# EAGLE schematic A6BP-3 (EAGLE 7.5.0)

## Sheet 1 of 5
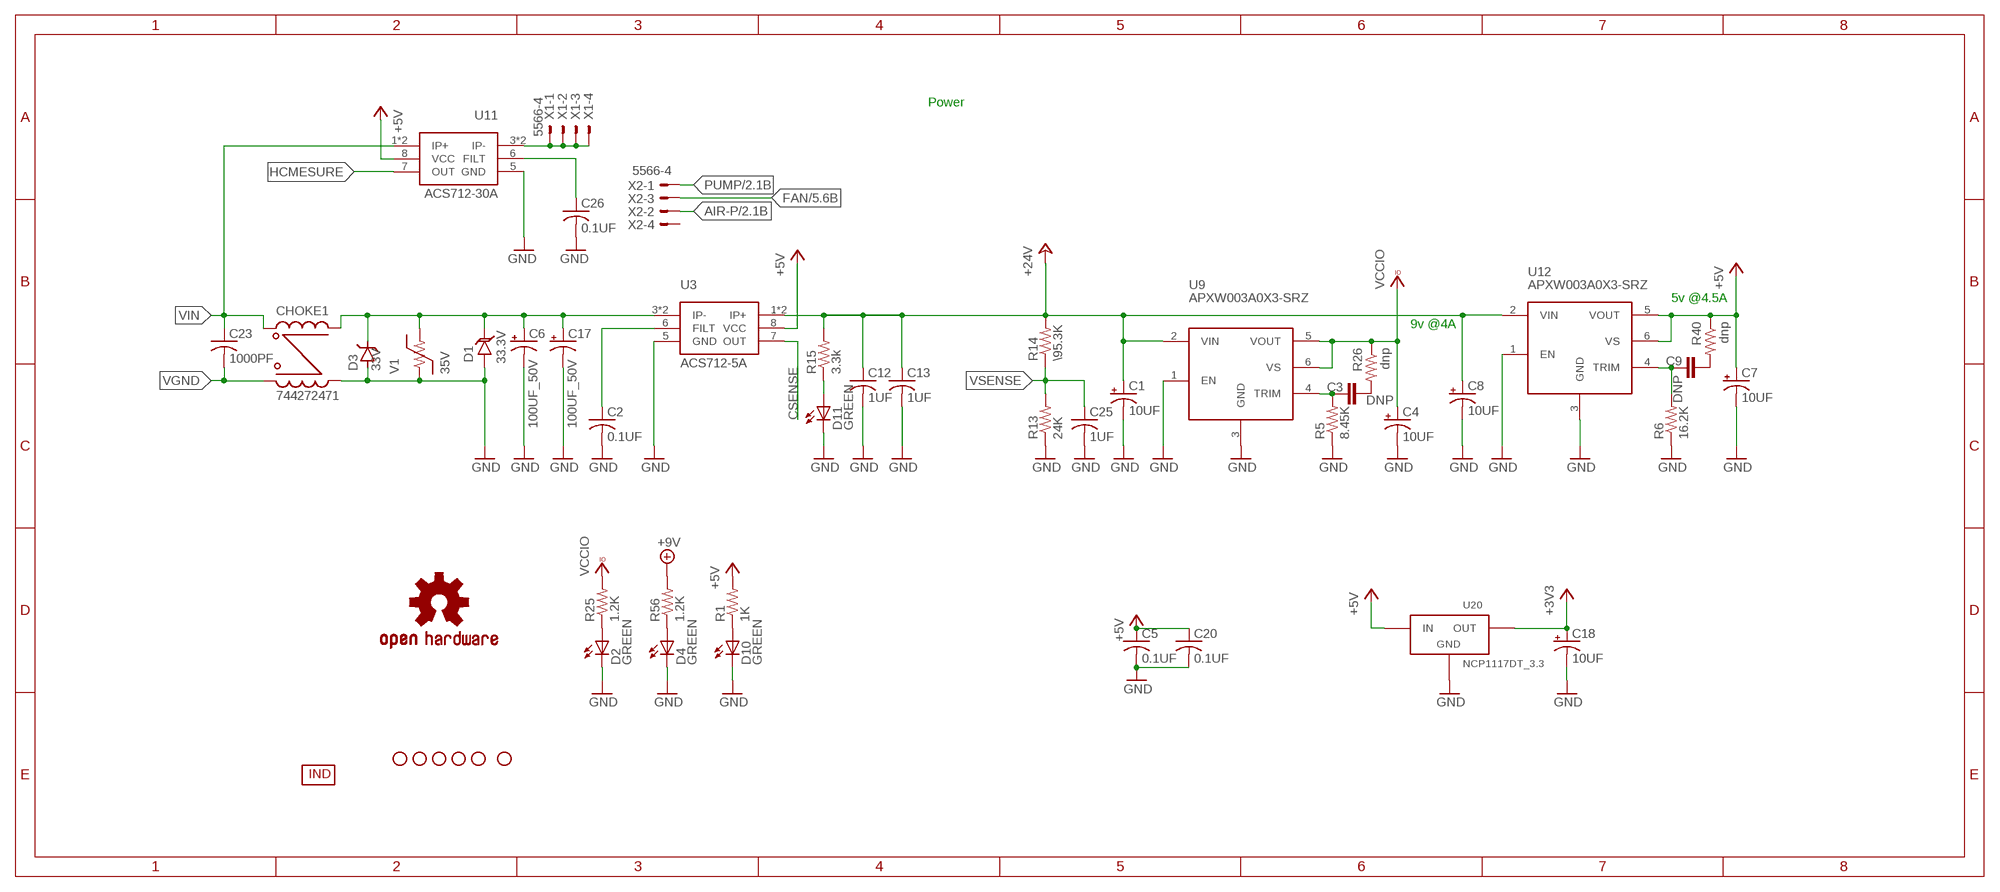
[diagram p0: schematic, sheet 1]

### Parts
C1  10UF  CAP-POL_10UF_60V  [EIA7343]
C2  0.1UF  CAP_0.1UF_50V_0805  [0805]
C3  DNP  CAP0805  [0805]
C4  10UF  CAP-POL_10UF_16V  [EIA3216-16V]
C5  0.1UF  CAP_0.1UF_50V_0805  [0805]
C6  100UF_50V  CAP-POL_100UF_50V_SMD  [PANASONIC-G]
C7  10UF  CAP-POL_10UF_16V  [EIA3216-16V]
C8  10UF  CAP-POL_10UF_60V  [EIA7343]
C9  DNP  CAP0805  [0805]
C12  1UF  CAP_1UF_50V  [1206@1]
C13  1UF  CAP_1UF_50V  [1206@1]
C17  100UF_50V  CAP-POL_100UF_50V_SMD  [PANASONIC-G]
C18  10UF  CAP-POL_10UF_16V  [EIA3216-16V]
C20  0.1UF  CAP_0.1UF_50V_0805  [0805]
C23  1000PF  CAP_1000PF_2KV  [C1825]
C25  1UF  CAP_1UF_50V_0805  [0805]
C26  0.1UF  CAP_0.1UF_50V_0805  [0805]
CHOKE1  744272471  [744272471]
D1  33.3V  TVS_33.3V  [SMA]
D2  GREEN  LED_GREEN  [CHIP_LED0805]
D3  33V  DIODE-ZENER_33V  [SMB]
D4  GREEN  LED_GREEN  [CHIP_LED0805]
D10  GREEN  LED_GREEN  [CHIP_LED0805]
D11  GREEN  LED_GREEN  [CHIP_LED0805]
R1  1K  RES_1K_1%_0805  [0805]
R5  8.45K  RES_8.45K_1%_0805  [0805]
R6  16.2K  RES_16.2K_1%_0805  [0805]
R13  24K  RES_24K_1%_0805  [0805]
R14  \95.3K  RES_95.3K_1%  [0805]
R15  3.3k  RES_3.3K_1%_0805  [0805]
R25  1.2K  RES_1.2K_1%_0805  [0805]
R26  dnp  R-US_R0805  [R0805]
R40  dnp  R-US_R0805  [R0805]
R56  1.2K  RES_1.2K_1%_0805  [0805]
STANDOFF2  STAND-OFF  [STAND-OFF]
STANDOFF3  STAND-OFF  [STAND-OFF]
STANDOFF5  STAND-OFF  [STAND-OFF]
STANDOFF6  STAND-OFF  [STAND-OFF]
STANDOFF7  STAND-OFF  [STAND-OFF]
STANDOFF8  STAND-OFF  [STAND-OFF]
U3  ACS712-5A  [SO-8]
U9  APXW003A0X3-SRZ  [APXW003A0X3-SRZ]
U11  ACS712-30A  [SO-8]
U12  APXW003A0X3-SRZ  [APXW003A0X3-SRZ]
U20  NCP1117DT_3.3  [DPAK]
U$8  OSHW-LOGOM  [OSHW-LOGO-M]
U$9  INDPK1  [PICKIT-PIN-1]
V1  35V  VARISTOR_35V  [0805]
X1  5566-4  [5566-4]
X2  5566-4  [5566-4]

### Nets
+3V3: C18.A(+) U20.2(OUT) ; also sheet 2
+5V: C5.1(+) C7.A(+) C20.1(+) R1.2 R40.1 U3.8(VCC) U11.8(VCC) U12.5(VOUT) U12.6(VS) U20.3(IN) ; also sheet 2,3,4,5
+9V: R56.2
+24V: C1.A(+) C8.A(+) C12.1(+) C13.1(+) R14.2 R15.2 U3.1(IP+) U3.2(IP+) U9.2(VIN) U12.2(VIN) ; also sheet 2,3
AIR-P: X2.2 ; also sheet 2
CSENSE: U3.7(OUT) ; also sheet 4
FAN: X2.3 ; also sheet 5
GND: C1.C(-) C2.2(-) C4.C(-) C5.2(-) C6.- C7.C(-) C8.C(-) C12.2(-) C13.2(-) C17.- C18.C(-) C20.2(-) C25.2(-) C26.2(-) CHOKE1.2 D1.A D2.C D3.A D4.C D10.C D11.C R5.1 R6.1 R13.1 U3.5(GND) U9.1(EN) U9.3(GND) U11.5(GND) U12.1(EN) U12.3(GND) U20.1(GND) V1.1 ; also sheet 2,3,4,5
HCMESURE: U11.7(OUT) ; also sheet 4
N$1: D2.A R25.1
N$3: D4.A R56.1
N$8: D10.A R1.1
N$18: C2.1(+) U3.6(FILT)
N$30: C6.+ C17.+ CHOKE1.3 D1.C D3.C U3.3(IP-) U3.4(IP-) V1.2
N$35: C3.1 R26.2
N$37: C3.2 R5.2 U9.4(TRIM)
N$42: D11.A R15.1
N$59: C9.1 R40.2
N$60: C9.2 R6.2 U12.4(TRIM)
N$61: U11.3(IP-) U11.4(IP-) X1.1 X1.2 X1.3 X1.4
N$63: C26.1(+) U11.6(FILT)
PUMP: X2.1 ; also sheet 2
VCCIO: C4.A(+) R25.2 R26.1 U9.5(VOUT) U9.6(VS) ; also sheet 4
VGND: C23.2(-) CHOKE1.1 ; also sheet 2
VIN: C23.1(+) CHOKE1.4 U11.1(IP+) U11.2(IP+) ; also sheet 2
VSENSE: C25.1(+) R13.2 R14.1 ; also sheet 4
Unconnected: X2.4

### Notes on the sheet
- Power
- 5v @4.5A
- 9v @4A

## Sheet 2 of 5
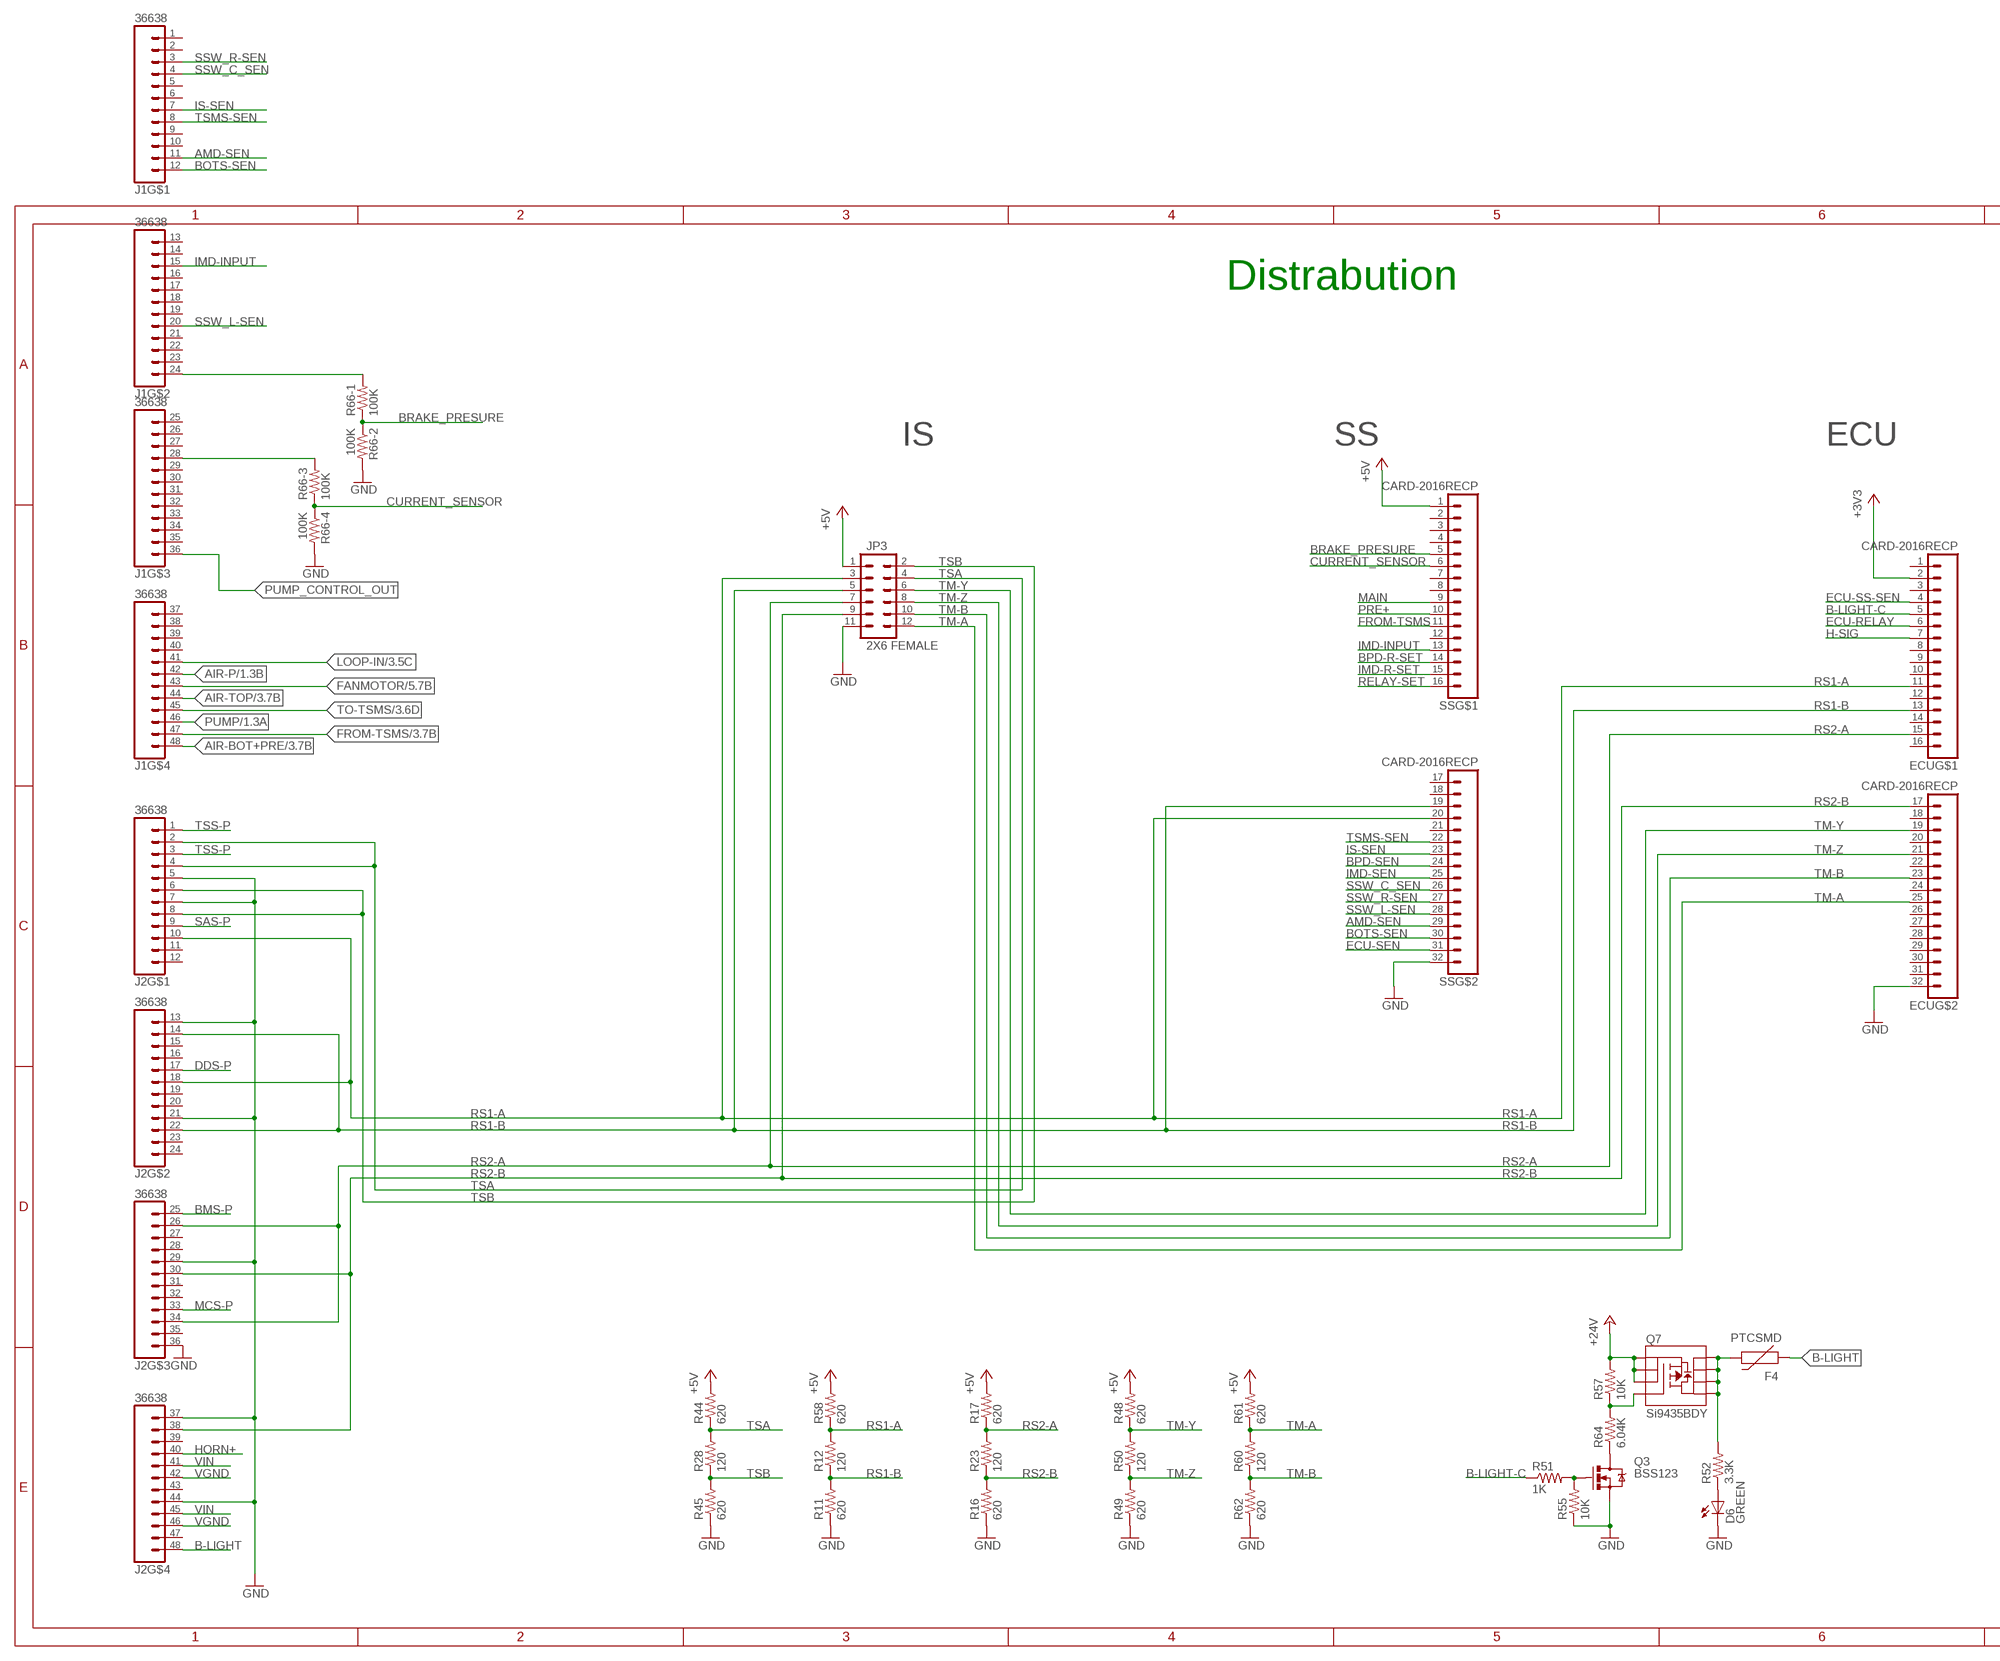
[diagram p1: schematic, sheet 2, part 1 of 2]
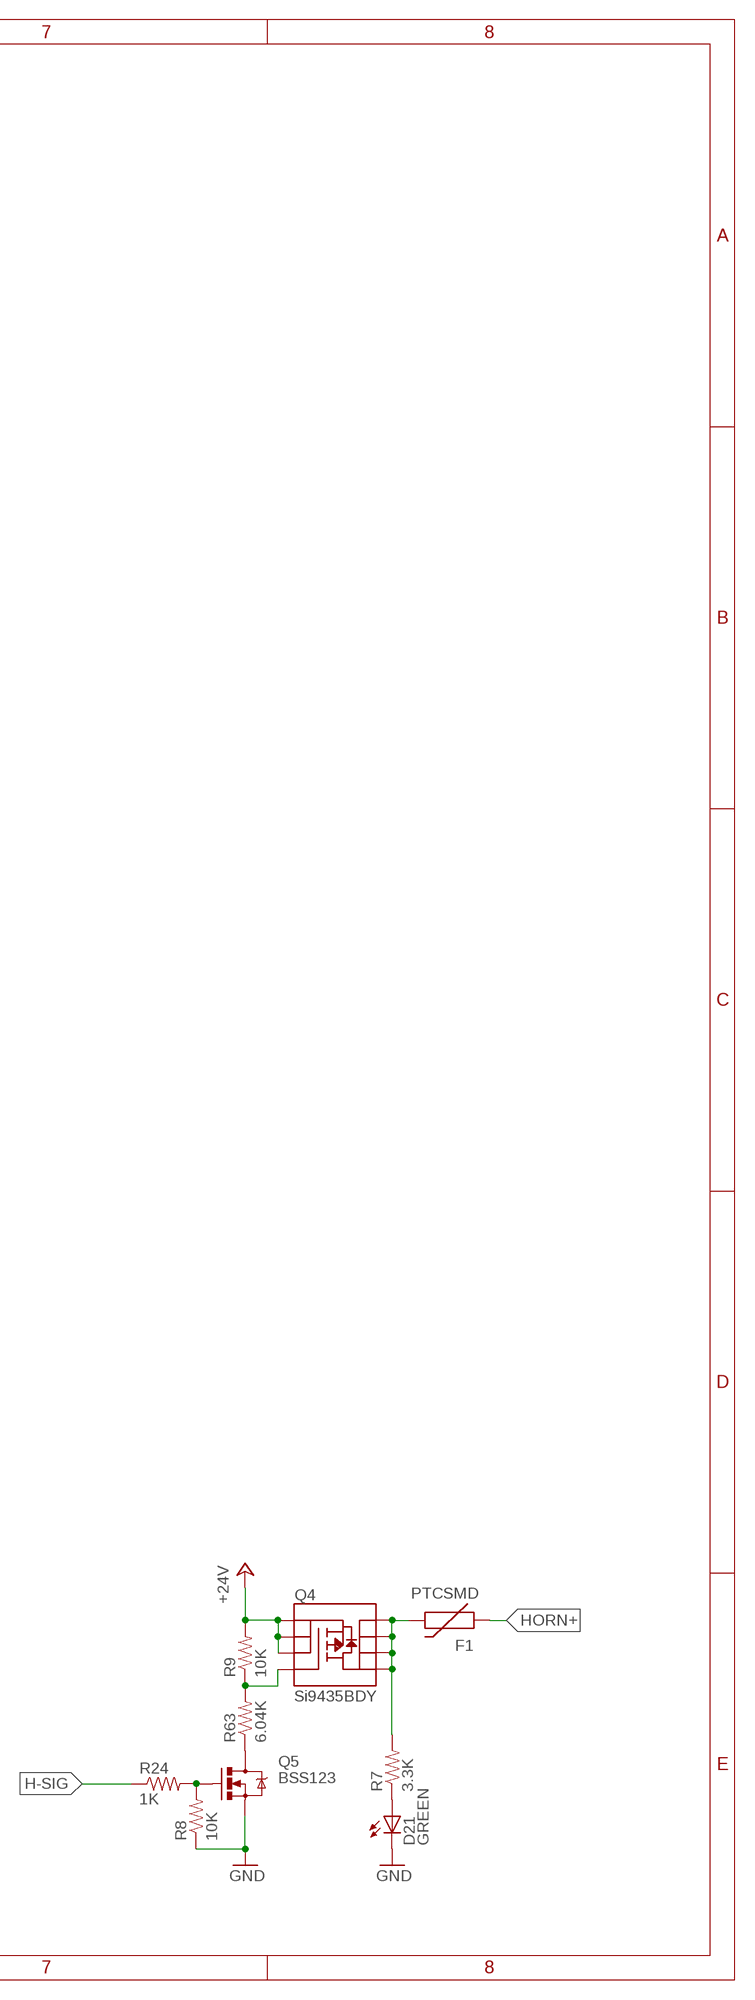
[diagram p2: schematic, sheet 2, part 2 of 2]

### Parts
D6  GREEN  LED_GREEN  [CHIP_LED0805]
D21  GREEN  LED_GREEN  [CHIP_LED0805]
ECU  CARD-2016RECP  [CARD-2016-RCP]
F1  PTCSMD  [PTC-1206]
F4  PTCSMD  [PTC-1206]
J1  36638  [36638]
J2  36638  [36638]
JP3  2X6 FEMALE  M06X2PTH_FEMALE  [2X6]
Q3  BSS123  MOS-N_BSS123  [SOT23]
Q4  Si9435BDY  MOSFET-PCHANNEL-SOIC8SOIC8  [SO08]
Q5  BSS123  MOS-N_BSS123  [SOT23]
Q7  Si9435BDY  MOSFET-PCHANNEL-SOIC8SOIC8  [SO08]
R7  3.3K  RES_3.3K_1%_0805  [0805]
R8  10K  RES_10K_1%_0805  [0805]
R9  10K  RES_10K_1%_0805  [0805]
R11  620  RES_620_1%_0805  [0805]
R12  120  RES_120_1%_0805  [0805]
R16  620  RES_620_1%_0805  [0805]
R17  620  RES_620_1%_0805  [0805]
R23  120  RES_120_1%_0805  [0805]
R24  1K  RES_1K_1%_0805  [0805]
R28  120  RES_120_1%_0805  [0805]
R44  620  RES_620_1%_0805  [0805]
R45  620  RES_620_1%_0805  [0805]
R48  620  RES_620_1%_0805  [0805]
R49  620  RES_620_1%_0805  [0805]
R50  120  RES_120_1%_0805  [0805]
R51  1K  RES_1K_1%_0805  [0805]
R52  3.3K  RES_3.3K_1%_0805  [0805]
R55  10K  RES_10K_1%_0805  [0805]
R57  10K  RES_10K_1%_0805  [0805]
R58  620  RES_620_1%_0805  [0805]
R60  120  RES_120_1%_0805  [0805]
R61  620  RES_620_1%_0805  [0805]
R62  620  RES_620_1%_0805  [0805]
R63  6.04K  RES_6.04K_1%  [0805]
R64  6.04K  RES_6.04K_1%  [0805]
R66  100K  RN-4_100K  [MNR14]
SS  CARD-2016RECP  [CARD-2016-RCP]

### Nets
+3V3: ECU.2 ; also sheet 1
+5V: JP3.1 R17.2 R44.2 R48.2 R58.2 R61.2 SS.1 ; also sheet 1,3,4,5
+24V: Q4.1(S) Q4.2(S) Q4.3(S) Q7.1(S) Q7.2(S) Q7.3(S) R9.2 R57.2 ; also sheet 1,3
AIR-BOT+PRE: J1.48 ; also sheet 3
AIR-P: J1.42 ; also sheet 1
AIR-TOP: J1.44 ; also sheet 3
AMD-SEN: J1.11 SS.29
B-LIGHT: F4.1 J2.48
B-LIGHT-C: ECU.5 R51.1
BMS-P: J2.25 ; also sheet 4
BOTS-SEN: J1.12 SS.30
BPD-R-SET: SS.14 ; also sheet 3
BPD-SEN: SS.24 ; also sheet 3
BRAKE_PRESURE: R66.1 R66.2 SS.5
CURRENT_SENSOR: R66.3 R66.4 SS.6
DDS-P: J2.17 ; also sheet 4
ECU-RELAY: ECU.6 ; also sheet 3
ECU-SEN: SS.31 ; also sheet 3
ECU-SS-SEN: ECU.4
FANMOTOR: J1.43 ; also sheet 5
FROM-TSMS: J1.47 SS.11 ; also sheet 3
GND: D6.C D21.C ECU.32 J2.5 J2.7 J2.13 J2.21 J2.29 J2.36 J2.37 J2.44 JP3.11 Q3.2(S) Q5.2(S) R8.1 R11.1 R16.1 R45.1 R49.1 R55.1 R62.1 R66.5 R66.7 SS.32 ; also sheet 1,3,4,5
H-SIG: ECU.7 R24.1
HORN+: F1.1 J2.40
IMD-INPUT: J1.15 SS.13
IMD-R-SET: SS.15 ; also sheet 3
IMD-SEN: SS.25 ; also sheet 3
IS-SEN: J1.7 SS.23
LOOP-IN: J1.41 ; also sheet 3
MAIN: SS.9 ; also sheet 3
MCS-P: J2.33 ; also sheet 4
N$5: Q4.4(G) R9.1 R63.2
N$9: F1.2 Q4.5(D) Q4.6(D) Q4.7(D) Q4.8(D) R7.2
N$12: D21.A R7.1
N$13: F4.2 Q7.5(D) Q7.6(D) Q7.7(D) Q7.8(D) R52.2
N$32: Q7.4(G) R57.1 R64.2
N$34: D6.A R52.1
N$41: Q5.1(G) R8.2 R24.2
N$52: Q5.3(D) R63.1
N$53: Q3.3(D) R64.1
N$57: J1.24 R66.8
N$84: Q3.1(G) R51.2 R55.2
N$87: J1.28 R66.6
PRE+: SS.10 ; also sheet 3
PUMP: J1.46 ; also sheet 1
PUMP_CONTROL_OUT: J1.36 ; also sheet 5
RELAY-SET: SS.16 ; also sheet 3
RS1-A: ECU.11 J2.10 J2.18 JP3.3 R12.2 R58.1 SS.20
RS1-B: ECU.13 J2.14 J2.22 JP3.5 R11.2 R12.1 SS.19
RS2-A: ECU.15 J2.26 J2.34 JP3.7 R17.1 R23.2 ; also sheet 4
RS2-B: ECU.17 J2.30 J2.38 JP3.9 R16.2 R23.1 ; also sheet 4
SAS-P: J2.9 ; also sheet 4
SSW_C_SEN: J1.4 SS.26
SSW_L-SEN: J1.20 SS.28
SSW_R-SEN: J1.3 SS.27
TM-A: ECU.25 JP3.12 R60.2 R61.1
TM-B: ECU.23 JP3.10 R60.1 R62.2
TM-Y: ECU.19 JP3.6 R48.1 R50.2
TM-Z: ECU.21 JP3.8 R49.2 R50.1
TO-TSMS: J1.45 ; also sheet 3
TSA: J2.2 J2.4 JP3.4 R28.2 R44.1
TSB: J2.6 J2.8 JP3.2 R28.1 R45.2
TSMS-SEN: J1.8 SS.22
TSS-P: J2.1 J2.3 ; also sheet 4
VGND: J2.42 J2.46 ; also sheet 1
VIN: J2.41 J2.45 ; also sheet 1
Unconnected: ECU.1 ECU.3 ECU.8 ECU.9 ECU.10 ECU.12 ECU.14 ECU.16 ECU.18 ECU.20 ECU.22 ECU.24 ECU.26 ECU.27 ECU.28 ECU.29 ECU.30 ECU.31 J1.1 J1.2 J1.5 J1.6 J1.9 J1.10 J1.13 J1.14 J1.16 J1.17 J1.18 J1.19 J1.21 J1.22 J1.23 J1.25 J1.26 J1.27 J1.29 J1.30 J1.31 J1.32 J1.33 J1.34 J1.35 J1.37 J1.38 J1.39 J1.40 J2.11 J2.12 J2.15 J2.16 J2.19 J2.20 J2.23 J2.24 J2.27 J2.28 J2.31 J2.32 J2.35 J2.39 J2.43 J2.47 SS.2 SS.3 SS.4 SS.7 SS.8 SS.12 SS.17 SS.18 SS.21

### Notes on the sheet
- Distrabution
- IS | SS | ECU

## Sheet 3 of 5
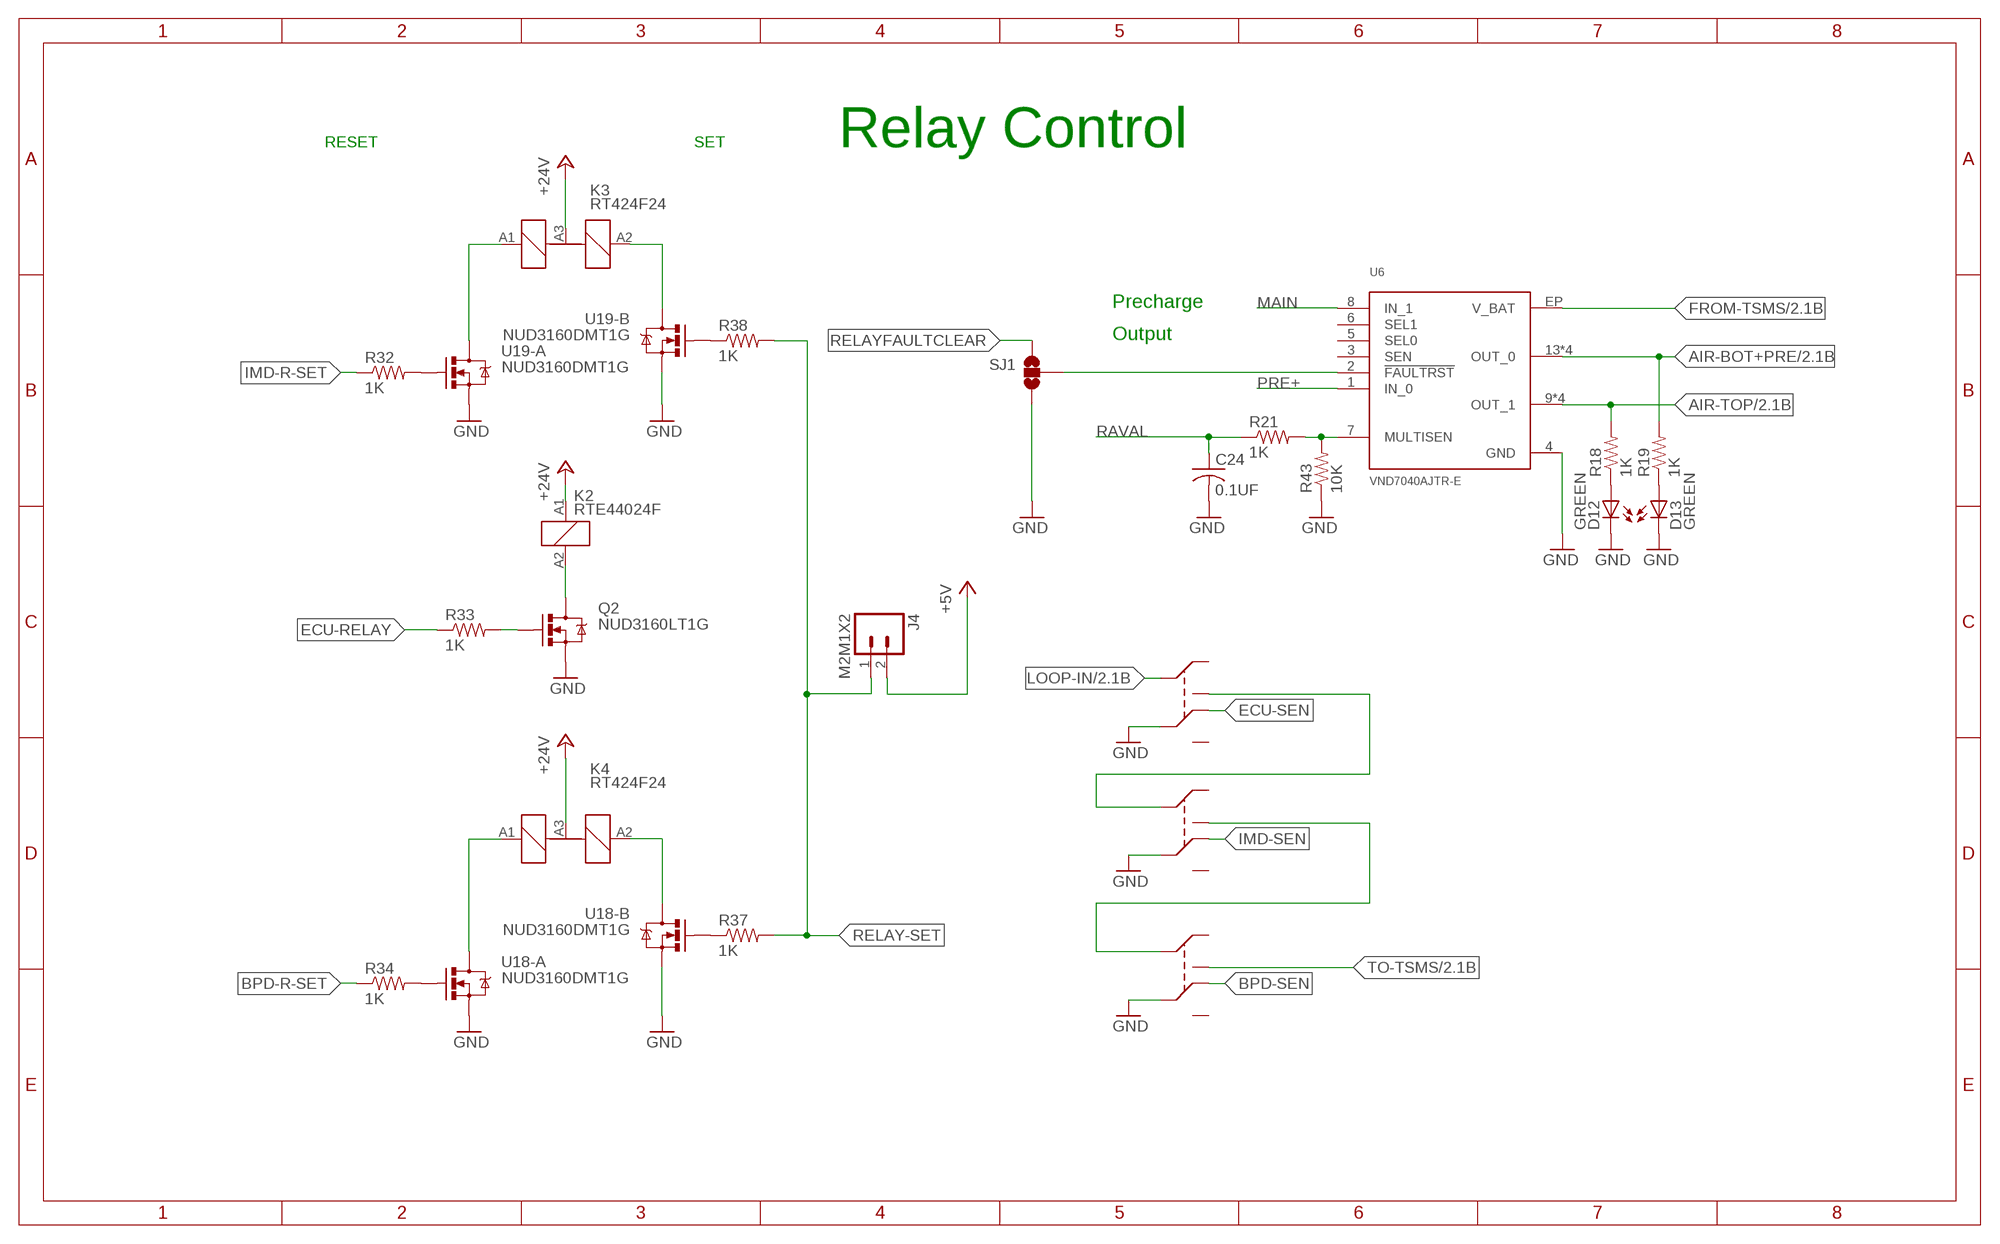
[diagram p3: schematic, sheet 3]

### Parts
C24  0.1UF  CAP_0.1UF_50V_0805  [0805]
D12  GREEN  LED_GREEN  [CHIP_LED0805]
D13  GREEN  LED_GREEN  [CHIP_LED0805]
J4  M2M1X2  [MOLEX-1X2]
K2  RTE44024F  [RTE44024F]
K3  RT424F24  [RT424F24]
K4  RT424F24  [RT424F24]
Q2  NUD3160LT1G  [SOT23]
R18  1K  RES_1K_1%_0805  [0805]
R19  1K  RES_1K_1%_0805  [0805]
R21  1K  RES_1K_1%_0805  [0805]
R32  1K  RES_1K_1%_0805  [0805]
R33  1K  RES_1K_1%_0805  [0805]
R34  1K  RES_1K_1%_0805  [0805]
R37  1K  RES_1K_1%_0805  [0805]
R38  1K  RES_1K_1%_0805  [0805]
R43  10K  RES_10K_1%_0805  [0805]
SJ1  JUMPER-PAD-3-NOFULL_BOX_SILK  [PAD-JUMPER-3-NO_YES_SILK_FULL_BOX]
U6  VND7040AJTR-E  [SSO-16-POWER]
U18  NUD3160DMT1G  [SC74-6]
U19  NUD3160DMT1G  [SC74-6]

### Nets
+5V: J4.2 ; also sheet 1,2,4,5
+24V: K2.A1(+) K3.A3(-) K4.A3(-) ; also sheet 1,2
AIR-BOT+PRE: R19.2 U6.13(OUT_0) U6.14(OUT_0) U6.15(OUT_0) U6.16(OUT_0) ; also sheet 2
AIR-TOP: R18.2 U6.9(OUT_1) U6.10(OUT_1) U6.11(OUT_1) U6.12(OUT_1) ; also sheet 2
BPD-R-SET: R34.1 ; also sheet 2
BPD-SEN: K4.22(NC2) ; also sheet 2
ECU-RELAY: R33.1 ; also sheet 2
ECU-SEN: K2.22(NC2) ; also sheet 2
FROM-TSMS: U6.EP(V_BAT) ; also sheet 2
GND: C24.2(-) D12.C D13.C K2.21(C2) K3.21(C2) K4.21(C2) Q2.2(S) R43.1 SJ1.3 U6.4(GND) U18.1(-A:S) U18.4(-B:S) U19.1(-A:S) U19.4(-B:S) ; also sheet 1,2,4,5
IMD-R-SET: R32.1 ; also sheet 2
IMD-SEN: K3.22(NC2) ; also sheet 2
LOOP-IN: K2.11(C1) ; also sheet 2
MAIN: U6.8(IN_1) ; also sheet 2
N$2: D12.A R18.1
N$6: R34.2 U18.2(-A:G)
N$7: K2.14(NO1) K3.11(C1)
N$10: D13.A R19.1
N$11: R21.2 R43.2 U6.7(MULTISEN)
N$14: SJ1.2 U6.2(!FAULTRST)
N$15: K3.14(NO1) K4.11(C1)
N$19: Q2.1(G) R33.2
N$23: R38.1 U19.5(-B:G)
N$45: K2.A2(-) Q2.3(D)
N$47: K3.A1(+1) U19.6(-A:D)
N$48: R32.2 U19.2(-A:G)
N$49: K3.A2(+2) U19.3(-B:D)
N$50: K4.A1(+1) U18.6(-A:D)
N$51: K4.A2(+2) U18.3(-B:D)
N$55: R37.1 U18.5(-B:G)
PRE+: U6.1(IN_0) ; also sheet 2
RAVAL: C24.1(+) R21.1
RELAY-SET: J4.1 R37.2 R38.2 ; also sheet 2
RELAYFAULTCLEAR: SJ1.1
TO-TSMS: K4.14(NO1) ; also sheet 2
Unconnected: K2.12(NC1) K2.24(NO2) K3.12(NC1) K3.24(NO2) K4.12(NC1) K4.24(NO2) U6.3(SEN) U6.5(SEL0) U6.6(SEL1)

### Notes on the sheet
- RESET | SET | Relay Control
- Precharge
- Output

## Sheet 4 of 5
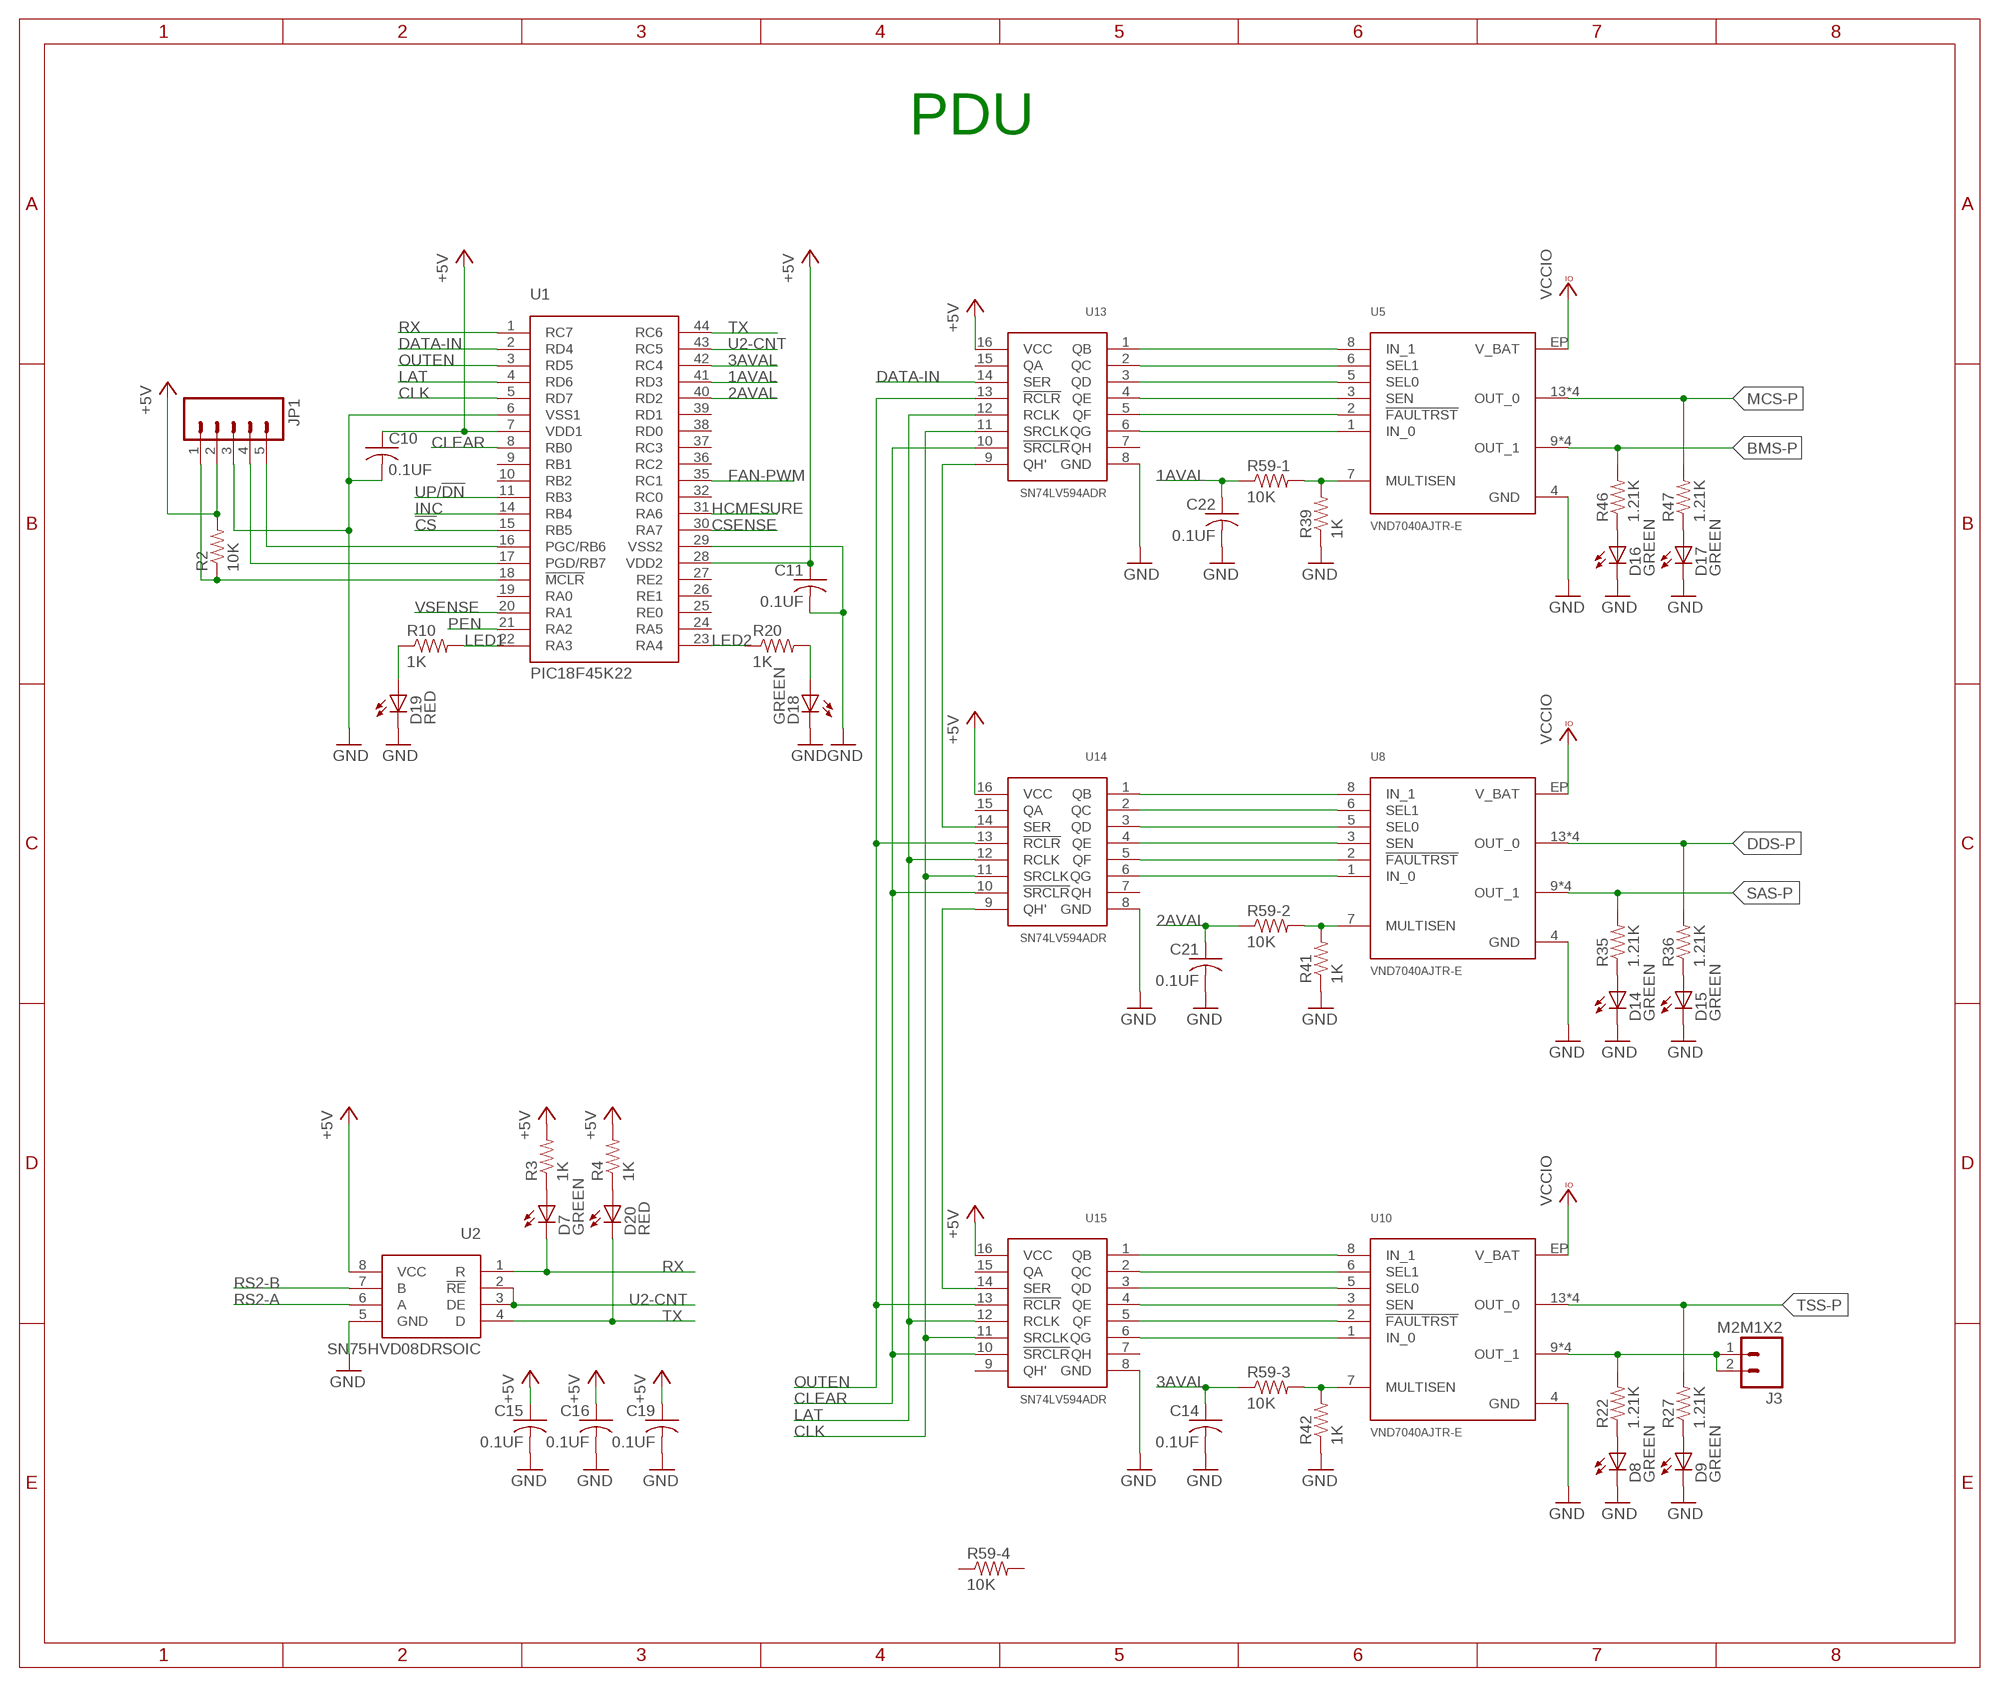
[diagram p4: schematic, sheet 4]

### Parts
C10  0.1UF  CAP_0.1UF_50V_0805  [0805]
C11  0.1UF  CAP_0.1UF_50V_0805  [0805]
C14  0.1UF  CAP_0.1UF_50V_0805  [0805]
C15  0.1UF  CAP_0.1UF_50V_0805  [0805]
C16  0.1UF  CAP_0.1UF_50V_0805  [0805]
C19  0.1UF  CAP_0.1UF_50V_0805  [0805]
C21  0.1UF  CAP_0.1UF_50V_0805  [0805]
C22  0.1UF  CAP_0.1UF_50V_0805  [0805]
D7  GREEN  LED_GREEN  [CHIP_LED0805]
D8  GREEN  LED_GREEN  [CHIP_LED0805]
D9  GREEN  LED_GREEN  [CHIP_LED0805]
D14  GREEN  LED_GREEN  [CHIP_LED0805]
D15  GREEN  LED_GREEN  [CHIP_LED0805]
D16  GREEN  LED_GREEN  [CHIP_LED0805]
D17  GREEN  LED_GREEN  [CHIP_LED0805]
D18  GREEN  LED_GREEN  [CHIP_LED0805]
D19  RED  LED_RED  [CHIP_LED0805]
D20  RED  LED_RED  [CHIP_LED0805]
J3  M2M1X2  [MOLEX-1X2]
JP1  M05LOCK_LONGPADS  [1X05_LOCK_LONGPADS]
R2  10K  RES_10K_1%_0805  [0805]
R3  1K  RES_1K_1%_0805  [0805]
R4  1K  RES_1K_1%_0805  [0805]
R10  1K  RES_1K_1%_0805  [0805]
R20  1K  RES_1K_1%_0805  [0805]
R22  1.21K  RES_1.21K_1%_0805  [0805]
R27  1.21K  RES_1.21K_1%_0805  [0805]
R35  1.21K  RES_1.21K_1%_0805  [0805]
R36  1.21K  RES_1.21K_1%_0805  [0805]
R39  1K  RES_1K_1%_0805  [0805]
R41  1K  RES_1K_1%_0805  [0805]
R42  1K  RES_1K_1%_0805  [0805]
R46  1.21K  RES_1.21K_1%_0805  [0805]
R47  1.21K  RES_1.21K_1%_0805  [0805]
R59  10K  RN-4_10K  [MNR14]
U1  PIC18F45K22  [TQFP-44]
U2  SN75HVD08DRSOIC  [SO-8]
U5  VND7040AJTR-E  [SSO-16-POWER]
U8  VND7040AJTR-E  [SSO-16-POWER]
U10  VND7040AJTR-E  [SSO-16-POWER]
U13  SN74LV594ADR  [SO-16]
U14  SN74LV594ADR  [SO-16]
U15  SN74LV594ADR  [SO-16]

### Nets
1AVAL: C22.1(+) R59.1 U1.41(RD3)
2AVAL: C21.1(+) R59.2 U1.40(RD2)
3AVAL: C14.1(+) R59.3 U1.42(RC4)
!CS: U1.15(RB5) ; also sheet 5
+5V: C10.1(+) C11.1(+) C15.1(+) C16.1(+) C19.1(+) JP1.2 R2.2 R3.2 R4.2 U1.7(VDD1) U1.28(VDD2) U2.8(VCC) U13.16(VCC) U14.16(VCC) U15.16(VCC) ; also sheet 1,2,3,5
BMS-P: R46.2 U5.9(OUT_1) U5.10(OUT_1) U5.11(OUT_1) U5.12(OUT_1) ; also sheet 2
CLEAR: U1.8(RB0) U13.10(!SRCLR) U14.10(!SRCLR) U15.10(!SRCLR)
CLK: U1.5(RD7) U13.11(SRCLK) U14.11(SRCLK) U15.11(SRCLK)
CSENSE: U1.30(RA7) ; also sheet 1
DATA-IN: U1.2(RD4) U13.14(SER)
DDS-P: R36.2 U8.13(OUT_0) U8.14(OUT_0) U8.15(OUT_0) U8.16(OUT_0) ; also sheet 2
FAN-PWM: U1.35(RC1) ; also sheet 5
GND: C10.2(-) C11.2(-) C14.2(-) C15.2(-) C16.2(-) C19.2(-) C21.2(-) C22.2(-) D8.C D9.C D14.C D15.C D16.C D17.C D18.C D19.C JP1.3 R39.1 R41.1 R42.1 U1.6(VSS1) U1.29(VSS2) U2.5(GND) U5.4(GND) U8.4(GND) U10.4(GND) U13.8(GND) U14.8(GND) U15.8(GND) ; also sheet 1,2,3,5
HCMESURE: U1.31(RA6) ; also sheet 1
INC: U1.14(RB4) ; also sheet 5
LAT: U1.4(RD6) U13.12(RCLK) U14.12(RCLK) U15.12(RCLK)
LED1: R10.2 U1.22(RA3)
LED2: R20.1 U1.23(RA4)
MCS-P: R47.2 U5.13(OUT_0) U5.14(OUT_0) U5.15(OUT_0) U5.16(OUT_0) ; also sheet 2
N$4: U5.8(IN_1) U13.1(QB)
N$16: D19.A R10.1
N$17: J3.1 J3.2 R22.2 U10.9(OUT_1) U10.10(OUT_1) U10.11(OUT_1) U10.12(OUT_1)
N$24: D7.A R3.1
N$25: D20.A R4.1
N$28: D8.A R22.1
N$29: D9.A R27.1
N$31: R42.2 R59.6 U10.7(MULTISEN)
N$33: U5.6(SEL1) U13.2(QC)
N$36: U5.5(SEL0) U13.3(QD)
N$39: U5.3(SEN) U13.4(QE)
N$40: JP1.4 U1.17(PGD/RB7)
N$43: JP1.5 U1.16(PGC/RB6)
N$44: U5.2(!FAULTRST) U13.5(QF)
N$46: JP1.1 R2.1 U1.18(!MCLR)
N$54: D18.A R20.2
N$58: U13.9(QH') U14.14(SER)
N$62: U5.1(IN_0) U13.6(QG)
N$64: U8.8(IN_1) U14.1(QB)
N$65: U8.6(SEL1) U14.2(QC)
N$66: U8.5(SEL0) U14.3(QD)
N$67: D14.A R35.1
N$68: D15.A R36.1
N$69: R39.2 R59.8 U5.7(MULTISEN)
N$70: U8.3(SEN) U14.4(QE)
N$71: U8.2(!FAULTRST) U14.5(QF)
N$72: U8.1(IN_0) U14.6(QG)
N$73: U10.8(IN_1) U15.1(QB)
N$74: U10.6(SEL1) U15.2(QC)
N$75: U10.5(SEL0) U15.3(QD)
N$76: U10.3(SEN) U15.4(QE)
N$77: U10.2(!FAULTRST) U15.5(QF)
N$78: U10.1(IN_0) U15.6(QG)
N$79: D16.A R46.1
N$80: U14.9(QH') U15.14(SER)
N$83: D17.A R47.1
N$85: R41.2 R59.7 U8.7(MULTISEN)
OUTEN: U1.3(RD5) U13.13(!RCLR) U14.13(!RCLR) U15.13(!RCLR)
PEN: U1.21(RA2)
RS2-A: U2.6(A) ; also sheet 2
RS2-B: U2.7(B) ; also sheet 2
RX: D7.C U1.1(RC7) U2.1(R)
SAS-P: R35.2 U8.9(OUT_1) U8.10(OUT_1) U8.11(OUT_1) U8.12(OUT_1) ; also sheet 2
TSS-P: R27.2 U10.13(OUT_0) U10.14(OUT_0) U10.15(OUT_0) U10.16(OUT_0) ; also sheet 2
TX: D20.C U1.44(RC6) U2.4(D)
U2-CNT: U1.43(RC5) U2.2(!RE) U2.3(DE)
UP/!DN: U1.11(RB3) ; also sheet 5
VCCIO: U5.EP(V_BAT) U8.EP(V_BAT) U10.EP(V_BAT) ; also sheet 1
VSENSE: U1.20(RA1) ; also sheet 1
Unconnected: R59.4 R59.5 U1.9(RB1) U1.10(RB2) U1.19(RA0) U1.24(RA5) U1.25(RE0) U1.26(RE1) U1.27(RE2) U1.32(RC0) U1.36(RC2) U1.37(RC3) U1.38(RD0) U1.39(RD1) U13.7(QH) U13.15(QA) U14.7(QH) U14.15(QA) U15.7(QH) U15.9(QH') U15.15(QA)

### Notes on the sheet
- PDU

## Sheet 5 of 5
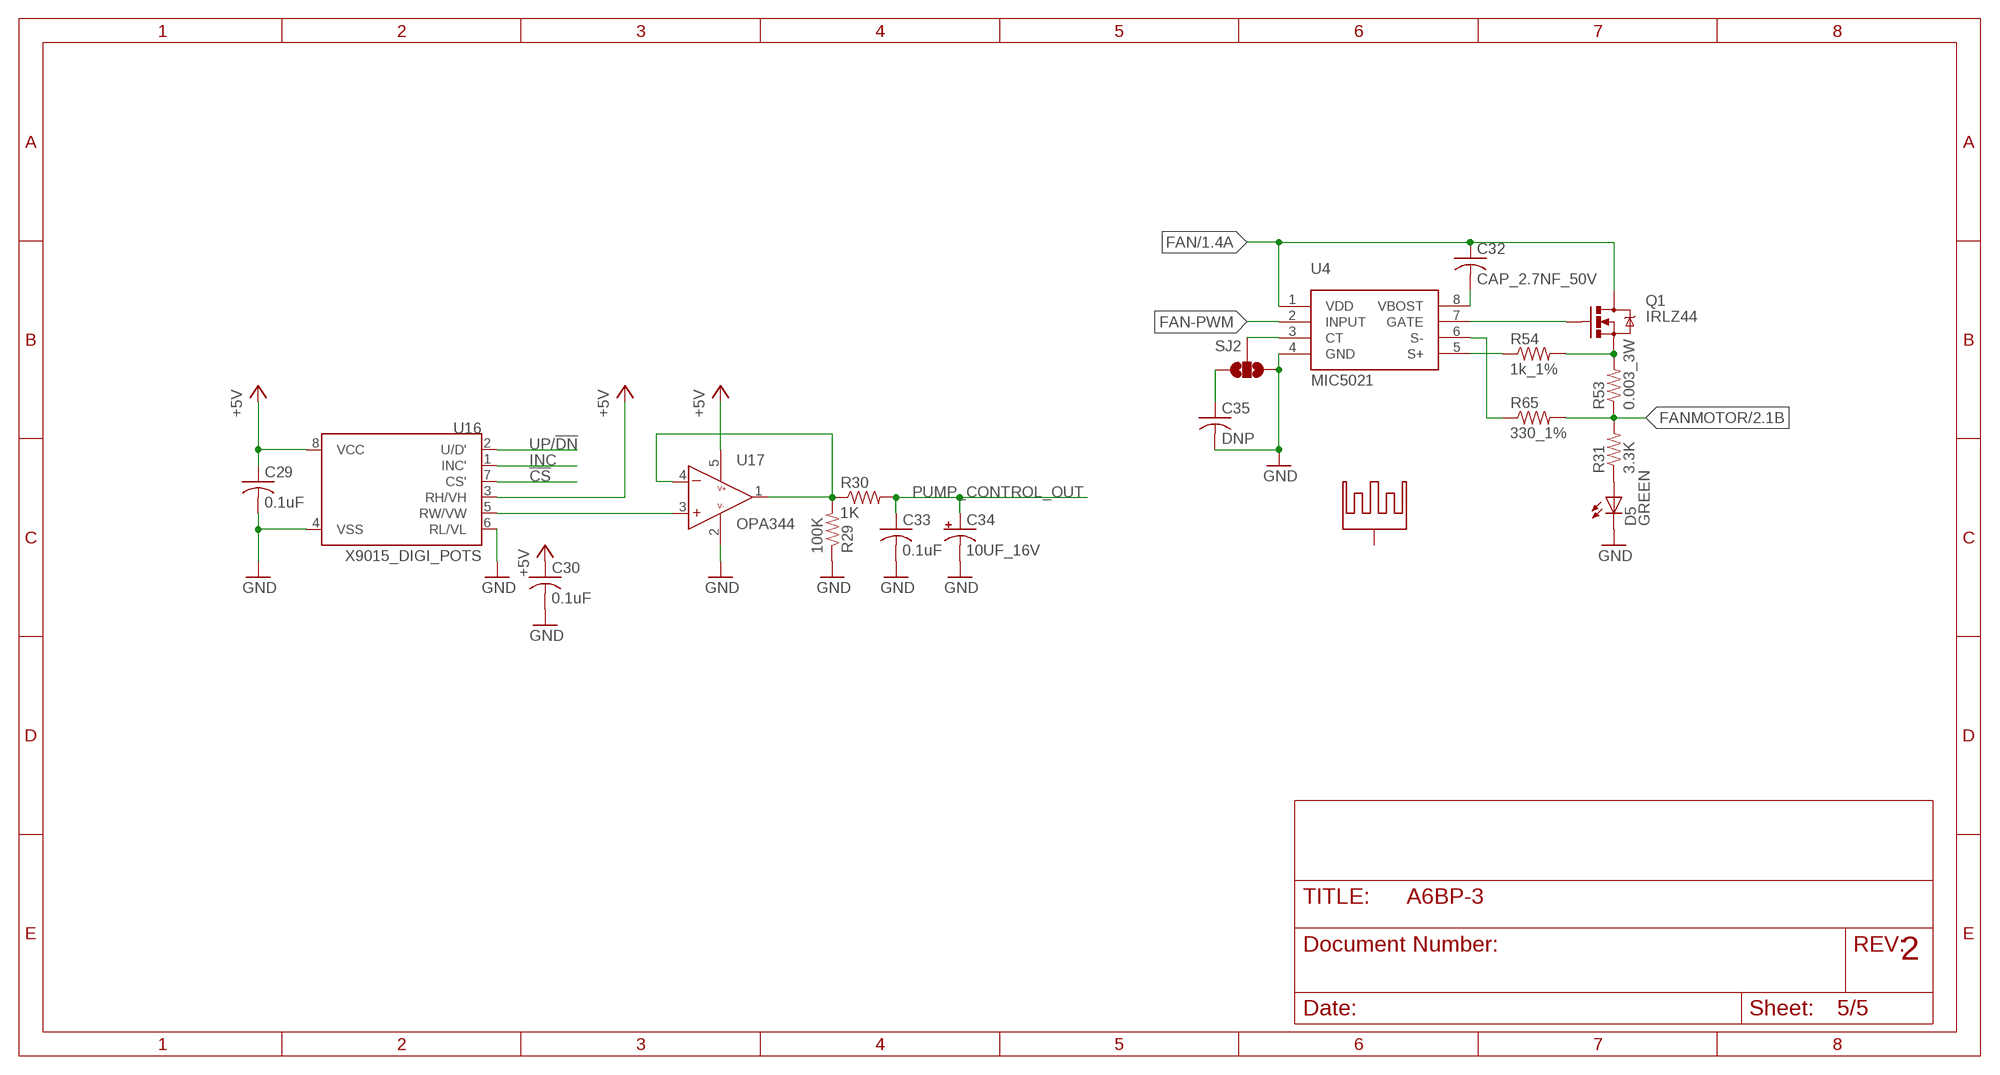
[diagram p5: schematic, sheet 5]

### Parts
C29  0.1uF  CAP_0.1UF_50V_0805  [0805]
C30  0.1uF  CAP_0.1UF_50V_0805  [0805]
C32  CAP_2.7NF_50V  [0805]
C33  0.1uF  CAP_0.1UF_50V_0805  [0805]
C34  10UF_16V  CAP-POL_10UF_16V  [EIA3216-16V]
C35  DNP  CAP_2.7NF_50V  [0805]
D5  GREEN  LED_GREEN  [CHIP_LED0805]
HS1  HEATSINK  [581002B02500G]
Q1  IRLZ44  MOS-N_IRLZ44  [TO-220]
R29  100K  RES_100K_1%_0805  [0805]
R30  1K  RES_1K_1%_0805  [0805]
R31  3.3K  RES_3.3K_1%_0805  [0805]
R53  0.003_3W  RES_0.003_3W_1%  [2512]
R54  1k_1%  RES_1K_1%_0805  [0805]
R65  330_1%  RES_330_1%_0805  [0805]
SJ2  JUMPER-PAD-3-NOFULL_BOX_SILK  [PAD-JUMPER-3-NO_YES_SILK_FULL_BOX]
U4  MIC5021  [SO-8]
U16  X9015_DIGI_POTS  [SO08]
U17  OPA344  [SOT23-5]

### Nets
!CS: U16.7(CS') ; also sheet 4
+5V: C29.1(+) C30.1(+) U16.3(RH/VH) U16.8(VCC) U17.5(V+) ; also sheet 1,2,3,4
FAN: C32.1(+) Q1.2(D) U4.1(VDD) ; also sheet 1
FAN-PWM: U4.2(INPUT) ; also sheet 4
FANMOTOR: R31.2 R53.1 R65.2 ; also sheet 2
GND: C29.2(-) C30.2(-) C33.2(-) C34.C(-) C35.2(-) D5.C R29.1 SJ2.1 U4.4(GND) U16.4(VSS) U16.6(RL/VL) U17.2(V-) ; also sheet 1,2,3,4
INC: U16.1(INC') ; also sheet 4
N$20: U16.5(RW/VW) U17.3(+)
N$21: Q1.1(G) U4.7(GATE)
N$22: D5.A R31.1
N$26: SJ2.2 U4.3(CT)
N$27: Q1.3(S) R53.2 R54.2
N$38: R54.1 U4.5(S+)
N$56: R65.1 U4.6(S-)
N$81: C32.2(-) U4.8(VBOST)
N$82: C35.1(+) SJ2.3
PUMP_CONTROL_OUT: C33.1(+) C34.A(+) R30.2 ; also sheet 2
PUMP_OUTPUT_CONTROL: R29.2 R30.1 U17.1(O) U17.4(-)
UP/!DN: U16.2(U/D') ; also sheet 4
Unconnected: HS1.1 HS1.2

### Notes on the sheet
- 2

## Library data of the parts
C1 C8 = FSAE Electric:CAP-POL; PARTNO: 293D106X9050E2TE3
C2 C5 C10 C11 C14-C16 C19-C22 C24 C26 C29 C30 C33 = FSAE Electric:CAP; PARTNO: CC0805ZRY5V9BB104
C3 C9 = SparkFun-Capacitors:CAP: Capacitor Standard 0603 ceramic capacitor, and 0.1" leaded capacitor.
C4 C7 C18 C34 = FSAE Electric:CAP-POL; PARTNO: T491A106M016AT
C6 C17 = FSAE Electric:CAP-POL; PARTNO: EEE-1HA101P
C12 C13 = FSAE Electric:CAP; PARTNO: CC1206ZRY5V9BB105
C23 = FSAE Electric:CAP; PARTNO: 1825GC102KAT1A
C25 = FSAE Electric:CAP; PARTNO: UMK212F105ZG-T
C32 C35 = FSAE Electric:CAP; PARTNO: CL21B272KBANNNC
CHOKE1 = FSAE Electric:744272471; PARTNO: 744272471
D1 = FSAE Electric:TVS; PARTNO: SMAJ30CAHE3/61
D2 D4-D18 D21 = FSAE Electric:LED; PARTNO: LTST-S220GKT
D3 = FSAE Electric:DIODE-ZENER: Zener Diodes; PARTNO: 1SMB5937B-13
D19 D20 = FSAE Electric:LED; PARTNO: LH R974-LP-1
ECU SS = FSAE Electric:CARD-2016
F1 F4 = SparkFun-PowerIC:PTC: Resettable Fuse PTC Resettable Fuse. Spark Fun Electronics SKU : COM-08357; PROD_ID: RES-11150
HS1 = FSAE Electric:HEATSINK
J1 J2 = FSAE Eletric:36638; PARTNO: 0366380002
J3 J4 = FSAE Electric:M2; PARTNO: 0022232021
JP1 = SparkFun-Connectors:M05: Header 5 Standard 5-pin 0.1" header. Use with straight break away headers (SKU : PRT-00116), right angle break away headers (PRT-00553), swiss pins (PRT-00743), machine pins (PRT-00117), and female headers (PRT-00115). Molex polarized connector foot print use with SKU : PRT-08230 with associated crimp pins and housings.
JP3 = SparkFun-Connectors:M06X2; PROD_ID: CONN-12423
K2 = FSAE Electric:RTE44024F; PARTNO: RTE44024F
K3 K4 = FSAE Electric:RT424F24; PARTNO: RT424F24
Q1 = FSAE Electric:MOS-N: N-Channel Mosfets; PARTNO: IRLZ44PBF
Q2 = FSAE Electric:NUD3160LT1G; PARTNO: NUD3160LT1G
Q3 Q5 = FSAE Electric:MOS-N: N-Channel Mosfets; PARTNO: BSS123,215
Q4 Q7 = SparkFun-DiscreteSemi:MOSFET-PCHANNEL-SOIC8: Generic 8-pin PMOSFET
R1 R3 R4 R10 R18-R21 R24 R30 R32-R34 R37-R39 R41 R42 R51 R54 = FSAE Electric:RES: Resistors; PARTNO: RC0805FR-071KL
R2 R8 R9 R43 R55 R57 = FSAE Electric:RES: Resistors; PARTNO: RC0805FR-0710KL
R5 = FSAE Electric:RES: Resistors; PARTNO: ERJ-6ENF8451V
R6 = FSAE Electric:RES: Resistors; PARTNO: RC0805FR-0716K2L
R7 R15 R31 R52 = FSAE Electric:RES: Resistors; PARTNO: RC0805FR-073K3L
R11 R16 R17 R44 R45 R48 R49 R58 R61 R62 = FSAE Electric:RES: Resistors; PARTNO: RC0805FR-07620RL
R12 R23 R28 R50 R60 = FSAE Electric:RES: Resistors; PARTNO: RC0805FR-07120RL
R13 = FSAE Electric:RES: Resistors; PARTNO: RC0805FR-0724KL
R14 = FSAE Electric:RES: Resistors; PARTNO: RC0805FR-0795K3L
R22 R27 R35 R36 R46 R47 = FSAE Electric:RES: Resistors; PARTNO: RC0805FR-071K21L
R25 R56 = FSAE Electric:RES: Resistors; PARTNO: RC0805FR-071K2L
R26 R40 = adafruit:R-US_: RESISTOR, American symbol
R29 = FSAE Electric:RES: Resistors; PARTNO: RC0805FR-07100KL
R53 = FSAE Electric:RES: Resistors; PARTNO: CRE2512-FZ-R003E-3
R59 = FSAE Electric:RN-4; PARTNO: MNR14ERAPJ103
R63 R64 = FSAE Electric:RES: Resistors; PARTNO: RMCF0805FT6K04
R65 = FSAE Electric:RES: Resistors; PARTNO: RC0805FR-07330RL
R66 = FSAE Electric:RN-4; PARTNO: MNR14ERAPJ104
SJ1 SJ2 = SparkFun-Passives:JUMPER-PAD-3-NO
STANDOFF2 STANDOFF3 STANDOFF5-STANDOFF8 = SparkFun-Electromechanical:STAND-OFF: #4 Stand Off This is the mechanical footprint for a #4 phillips button head screw. Use the keepout ring to avoid running the screw head into surrounding components. SKU : PRT-00447
U1 = FSAE Electric:PIC18F45K22: Microprocessor used in many places on the car View on DigiKey <http://www.digikey.com/product-detail/en/PIC18F45K22T-I%2FPT/PIC18F45K22T-I%2FPTCT-ND/5169582>; PARTNO: PIC18F45K22T-I/PT
U2 = FSAE Electric:SN75HVD08DR: RS485 Transceiver View on DigiKey <http://www.digikey.com/product-detail/en/SN75HVD08DR/296-37893-1-ND/4899996>; PARTNO: SN75HVD08DR
U3 = FSAE Electric:ACS712: Hall Effect Current Sensor 30A View on DigiKey <http://www.digikey.com/product-detail/en/ACS712ELCTR-30A-T/620-1191-1-ND/1284608>; PARTNO: ACS712ELCTR-05B-T
U4 = FSAE Electric:MIC5021; PARTNO: MIC5014YM-TR
U5 U6 U8 U10 = FSAE Electric:VND7040AJTR-E; PARTNO: VND7040AJTR-E
U9 U12 = FSAE Electric:APXW003A0X3-SRZ; PARTNO: APXW003A0X3-SRZ
U11 = FSAE Electric:ACS712: Hall Effect Current Sensor 30A View on DigiKey <http://www.digikey.com/product-detail/en/ACS712ELCTR-30A-T/620-1191-1-ND/1284608>; PARTNO: ACS712ELCTR-30A-T
U13-U15 = FSAE Electric:SN74LV594ADR; PARTNO: SN74LV594ADR
U16 = SparkFun-AnalogIC:X9015_DIGI_POT: Digital pot- up/down/increment control only; PARTNO: X9313WSZT1
U17 = FSAE Electric:OPA344; PARTNO: OPA344NA/3K
U18 U19 = FSAE Electric:NUD3160DMT1G; PARTNO: NUD3160DMT1G
U20 = FSAE Electric:NCP1117DT; PARTNO: NCP1117DT33RKG
U$8 = SparkFun:OSHW-LOGO: Open Source Hardware Logo This logo indicates the piece of hardware it is found on incorporates a OSHW license and/or adheres to the definition of open source hardware found here: http://freedomdefined.org/OSHW
U$9 = FSAE Eletric:IND
V1 = FSAE Electric:VARISTOR; PARTNO: VC080531C650DP
X1 X2 = con-molex:5566-4: Mini FIT connector 4 pol Source: http://www.molex.com; OC_FARNELL: unknown; OC_NEWARK: unknown

## Net classes
1 power: width 0.61 mm, drill 0.711 mm, clearance 0.203 mm